# EAGLE design board (EAGLE 6.3)
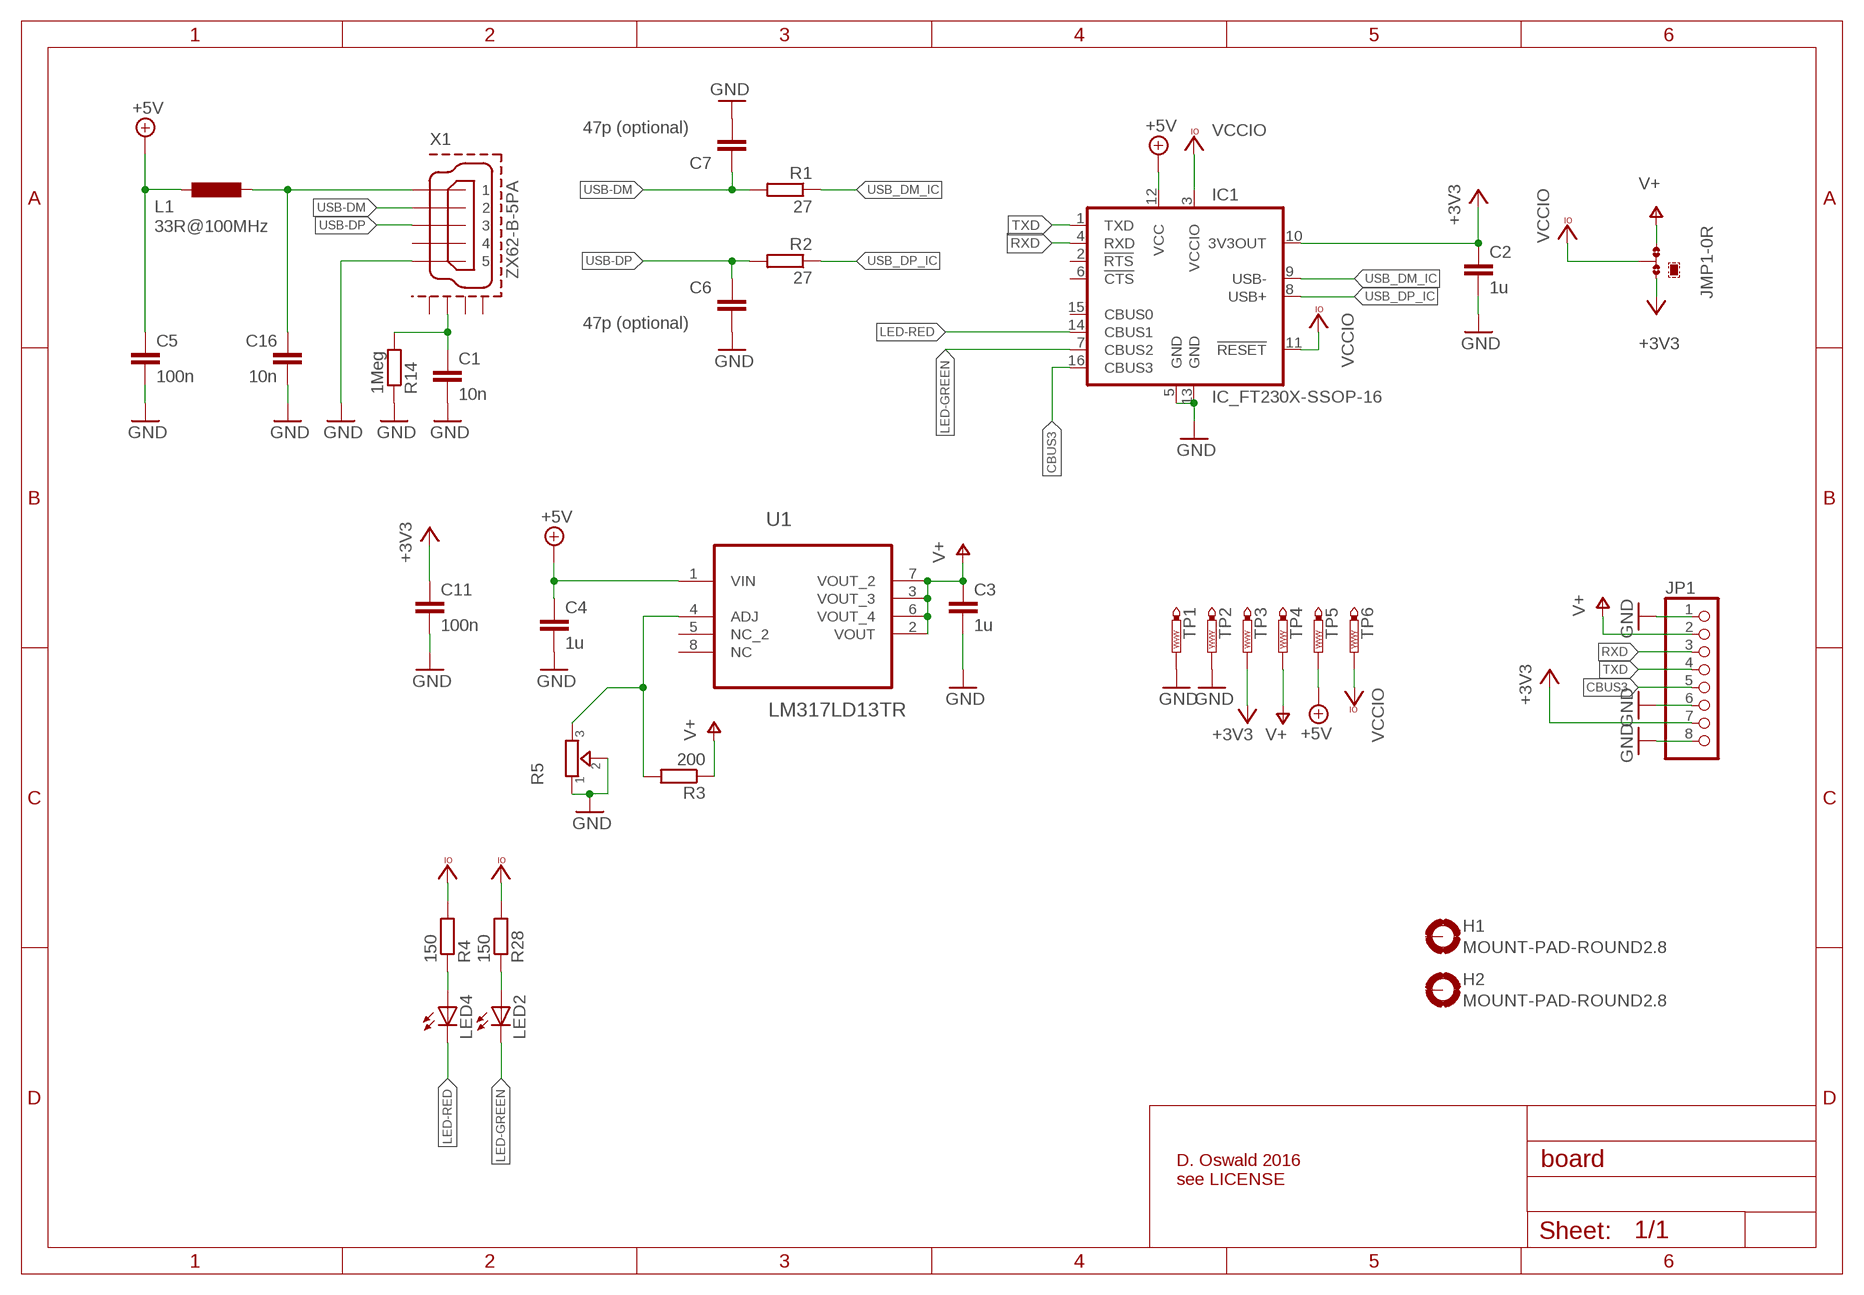
[diagram p0: schematic, sheet 1]

## Parts
C1  10n  C-EUC0603K  [C0603K]
C2  1u  C-EUC0805K  [C0805K]
C3  1u  C-EUC0805K  [C0805K]
C4  1u  C-EUC0805K  [C0805K]
C5  100n  C-EUC0603K  [C0603K]
C6  47p (optional)  C-EUC0603K  [C0603K]
C7  47p (optional)  C-EUC0603K  [C0603K]
C11  100n  C-EUC0603K  [C0603K]
C16  10n  C-EUC0603K  [C0603K]
H1  MOUNT-PAD-ROUND2.8  [2,8-PAD]
H2  MOUNT-PAD-ROUND2.8  [2,8-PAD]
IC1  IC_FT230X-SSOP-16  [SSOP-16-FTDI]
JMP1  0R-JUMPA  [A0R-JMP]
JP1  PINHD-1X8/90  [1X08/90]
L1  33R@100MHz  L-EUL2012C  [L2012C]
LED2  LEDCHIPLED_0805  [CHIPLED_0805]
LED4  LEDCHIPLED_0805  [CHIPLED_0805]
R1  27  R-EU_R0603  [R0603]
R2  27  R-EU_R0603  [R0603]
R3  200  R-EU_R0805  [R0805]
R4  150  R-EU_R0603  [R0603]
R5  TRIMMER-3314G  [TRIMMER_3314G]
R14  1Meg  R-EU_R0603  [R0603]
R28  150  R-EU_R0603  [R0603]
TP1  PTR1B1,27  [B1,27]
TP2  PTR1B1,27  [B1,27]
TP3  PTR1B1,27  [B1,27]
TP4  PTR1B1,27  [B1,27]
TP5  PTR1B1,27  [B1,27]
TP6  PTR1B1,27  [B1,27]
U1  LM317LD13TR  [SOIC127P600X175-8N]
X1  ZX62-B-5PA  ZX62-B-5PA-LONG  [ZX62-B-5PA-LONG]

## Nets
+3V3: C2.1 C11.1 IC1.10(3V3OUT) JMP1.1 JP1.7 TP3.TP
+5V: C4.1 C5.1 IC1.12(VCC) L1.2 TP5.TP U1.1(VIN)
CBUS3: IC1.16(CBUS3) JP1.5
GND: C1.2 C2.2 C3.2 C4.2 C5.2 C6.2 C7.1 C11.2 C16.2 IC1.5(GND) IC1.13(GND) JP1.1 JP1.6 JP1.8 R5.1 R5.2 R14.1 TP1.TP TP2.TP X1.5
LED-GREEN: IC1.7(CBUS2) LED2.C
LED-RED: IC1.14(CBUS1) LED4.C
N$1: R3.2 R5.3 U1.4(ADJ)
N$2: LED2.A R28.1
N$3: LED4.A R4.1
N$7: C16.1 L1.1 X1.1
N$59: C1.1 R14.2 X1.P$2(GND2)
RXD: IC1.4(RXD) JP1.3
TXD: IC1.1(TXD) JP1.4
USB-DM: C7.2 R1.2 X1.2
USB-DP: C6.1 R2.2 X1.3
USB_DM_IC: IC1.9(USB-) R1.1
USB_DP_IC: IC1.8(USB+) R2.1
V+: C3.1 JMP1.3 JP1.2 R3.1 TP4.TP U1.2(VOUT) U1.3(VOUT_3) U1.6(VOUT_4) U1.7(VOUT_2)
VCCIO: IC1.3(VCCIO) IC1.11(!RESET) JMP1.2 R4.2 R28.2 TP6.TP
Unconnected: H1.B2,8(MOUNT) H2.B2,8(MOUNT) IC1.2(!RTS) IC1.6(!CTS) IC1.15(CBUS0) U1.5(NC_2) U1.8(NC) X1.4 X1.P$1(GND1) X1.P$5(GND4) X1.P$6(GND3)

## Notes on the sheet
- D. Oswald 2016
  see LICENSE

## Library data of the parts
C1-C7 C11 C16 = rcl:C-EU: CAPACITOR, European symbol
H1 H2 = holes:MOUNT-PAD-ROUND: MOUNTING PAD, round
IC1 = dp_devices:IC_FT230X: BASIC USB to UART IC
JMP1 = jump-0r-smd:0R-JUMP: SMD 0R 0805 Jumper
JP1 = pinhead:PINHD-1X8: PIN HEADER
L1 = rcl:L-EU: INDUCTOR, European symbol
LED2 LED4 = adafruit:LED: LED OSRAM: - CHIPLED LG R971, LG N971, LY N971, LG Q971, LY Q971, LO R971, LY R971 LH N974, LH R974 LS Q976, LO Q976, LY Q976 LO Q996 - Hyper CHIPLED LW Q18S LB Q993, LB Q99A, LB R99A - SideLED LS A670, LO A670, LY A670, LG A670, LP A670 LB A673, LV A673, LT A673, LW A673 LH A674 LY A675 LS A676, LA A676, LO A676, LY A676, LW A676 LS A679, LY A679, LG A679 - Hyper Micro SIDELED® LS Y876, LA Y876, LO Y876, LY Y876 LT Y87S - SmartLED LW L88C, LW L88S LB L89C, LB L89S, LG L890 LS L89K, LO L89K, LY L89K LS L896, LA L896, LO L896, LY L896 - TOPLED LS T670, LO T670, LY T670, LG T670, LP T670 LSG T670, LSP T670, LSY T670, LOP T670, LYG T670 LG T671, LOG T671, LSG T671 LB T673, LV T673, LT T673, LW T673 LH T674 LS T676, LA T676, LO T676, LY T676, LB T676, LH T676, LSB T676, LW T676 LB T67C, LV T67C, LT T67C, LS T67K, LO T67K, LY T67K, LW E67C LS E67B, LA E67B, LO E67B, LY E67B, LB E67C, LV E67C, LT E67C LW T67C LS T679, LY T679, LG T679 LS T770, LO T770, LY T770, LG T770, LP T770 LB T773, LV T773, LT T773, LW T773 LH T774 LS E675, LA E675, LY E675, LS T675 LS T776, LA T776, LO T776, LY T776, LB T776 LHGB T686 LT T68C, LB T68C - Hyper Mini TOPLED® LB M676 - Mini TOPLED Santana® LG M470 LS M47K, LO M47K, LY M47K Source: http://www.osram.convergy.de/
R1-R4 R14 R28 = rcl:R-EU_: RESISTOR, European symbol
R5 = dp_devices:TRIMMER: Trimmer resistor
TP1-TP6 = testpad:PTR1: TEST PIN
U1 = lm317ld:LM317LD13TR: Micropower 200 mA Low Dropout Tracking Regulator/Line Driver; MPN: LM317LD13TR; OC_FARNELL: 2253488; OC_NEWARK: 89K0679; PACKAGE: SOIC-8; SUPPLIER: STMICROELECTRONICS
X1 = Hirose-USB:ZX62-B-5PA

## Board
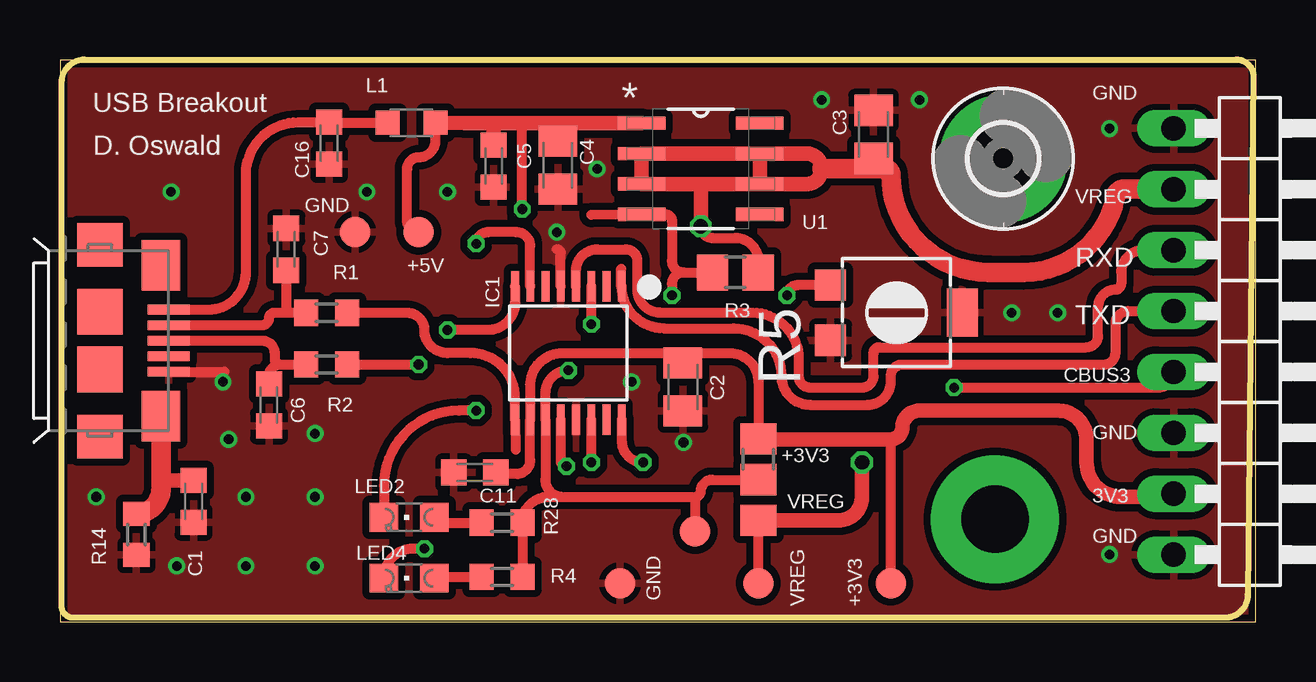
[diagram p1: board, top side]
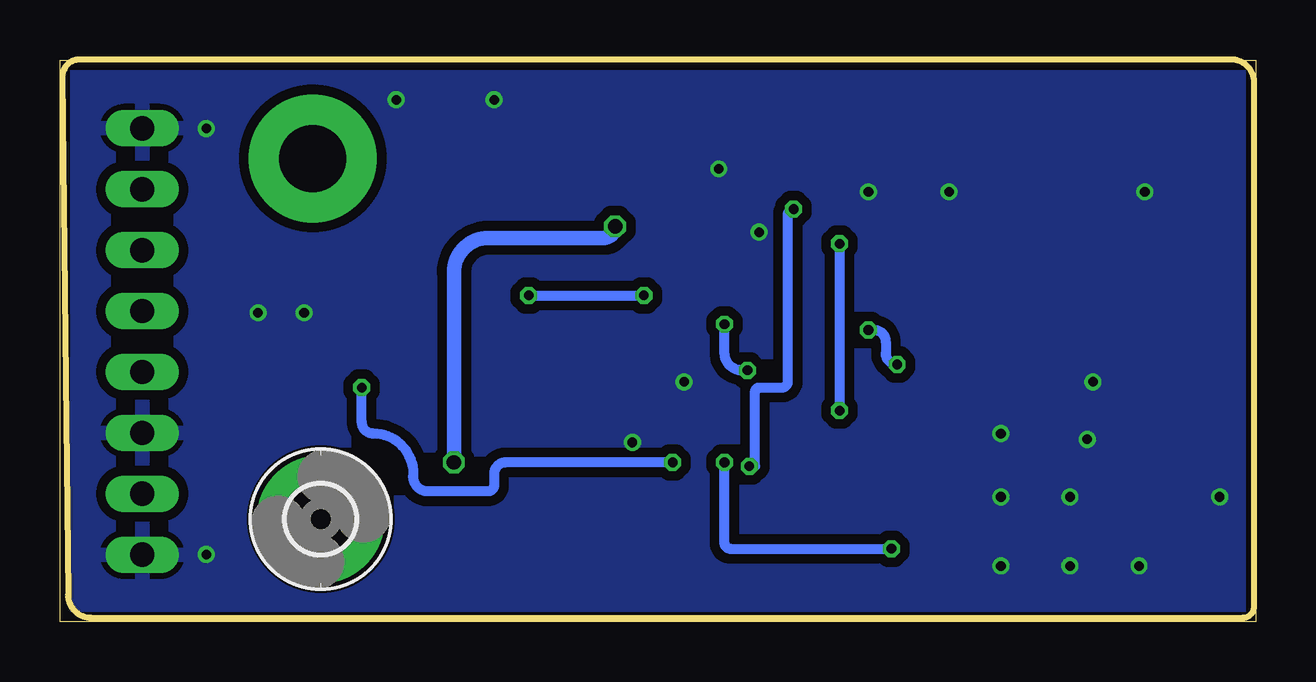
[diagram p2: board, bottom side, seen from below]

Size 49.85 x 23.43 mm. Coordinates in mm from the lower left corner, seen from the top.
Outline: 0,23.43 0,0 49.85,0 49.85,23.43 0,23.43
Copper layers (1*16): Top 0.035mm / dielectric 1.5mm / Bottom 0.035mm
Design rules "dirt_cheap_dirty_boards.v1": minimum track width 5mil, minimum drill 12mil, track to track 5mil, track to pad 5mil, pad to pad 5mil, via to via 5mil, smd to smd 0mil, copper to edge 10mil, drill to drill 10mil, minimum pad ring 10mil, minimum via ring 6mil, stop-mask expansion 2mil, vias tented up to drill 25mil, thermal gap 10mil
Milling: 8 lines

### Footprints (pad centres in the part's own frame; a part is rotated, then mirrored left to right if it is on the bottom)
C0603K = smd 1.05 x 1.08: 1 -0.875,0; 2 0.875,0
C0805K = smd 1.3 x 1.6: 1 -1,0; 2 1,0
2,8-PAD = drill 2.8 pad 5.334: B2,8 0,0
SSOP-16-FTDI = smd 0.32 x 1.26: 1 -2.223,-2.779; 2 -1.588,-2.779; 3 -0.953,-2.779; 4 -0.318,-2.779; 5 0.317,-2.779; 6 0.952,-2.779; 7 1.587,-2.779; 8 2.222,-2.779; 9 2.222,2.779; 10 1.587,2.779; 11 0.952,2.779; 12 0.317,2.779; 13 -0.318,2.779; 14 -0.953,2.779; 15 -1.588,2.779; 16 -2.223,2.779
A0R-JMP = smd 1.5 x 1.3: 1 0,1.7; 2 0,0; 3 0,-1.7
1X08/90 = drill 1.016 long: 1 -8.89,-3.81; 2 -6.35,-3.81; 3 -3.81,-3.81; 4 -1.27,-3.81; 5 1.27,-3.81; 6 3.81,-3.81; 7 6.35,-3.81; 8 8.89,-3.81
L2012C = smd 1 x 1: 1 -1,0; 2 1,0
CHIPLED_0805 = smd 1.2 x 1.2: A 0,-1.05; C 0,1.05
R0603 = smd 1 x 1.1: 1 -0.85,0; 2 0.85,0
R0805 = smd 1.3 x 1.5: 1 -0.95,0; 2 0.95,0
TRIMMER_3314G = smd 1.3 x 1.3: 1 -1.15,2.75; 3 1.15,2.75 | smd 2 x 1.3: 2 0,-2.75
B1,27 = smd 1.27 x 1.27: TP 0,0
SOIC127P600X175-8N = smd 1.981 x 0.559: 1 -2.464,1.905; 2 -2.464,0.635; 3 -2.464,-0.635; 4 -2.464,-1.905; 5 2.464,-1.905; 6 2.464,-0.635; 7 2.464,0.635; 8 2.464,1.905
ZX62-B-5PA-LONG = smd 0.4 x 1.75: 1 -1.3,2.875; 2 -0.65,2.875; 3 0,2.875; 4 0.65,2.875; 5 1.3,2.875 | smd 2.1 x 1.6: P$1 -3.15,2.55; P$2 3.15,2.55 | smd 1.8 x 1.9: P$3 -4,0; P$4 4,0 | smd 1.9 x 1.9: P$5 -1.2,0; P$6 1.2,0

### Placement (x,y rotation side)
C1  5.57,5.03 270 top
C2  25.96,9.8 270 top
C3  33.91,20.33 90 top
C4  20.75,19.04 270 top
C5  18.08,19 270 top
C6  8.71,9.05 270 top
C7  9.43,15.53 270 top
C11  17.29,6.23 180 top
C16  11.22,19.96 270 top
H1  39.32,19.32 0 top
H2  38.98,4.28 0 bottom
IC1  21.19,11.21 180 top
JMP1  29.11,5.93 0 top
JP1  50.23,11.69 270 top
L1  14.65,20.81 0 top
LED2  14.55,4.36 90 top
LED4  14.55,1.82 90 top
R1  11.11,12.89 180 top
R2  11.11,10.73 180 top
R3  28.15,14.57 180 top
R4  18.43,1.88 0 top
R5  34.87,12.89 90 top
R14  3.19,3.64 90 top
R28  18.43,4.14 0 top
TP1  23.35,1.61 0 top
TP2  12.31,16.25 0 top
TP3  34.63,1.61 0 top
TP4  29.11,1.61 0 top
TP5  14.95,16.25 0 top
TP6  26.47,3.77 0 top
U1  26.71,18.89 0 top
X1  1.66,11.72 270 top

### Tracks (layer width: path | path; a pad name or v marks a point on that pad's centre or on a via)
+3V3
  Top 0.406: 26.23,11.21 20.95,11.21 arc90 19.6,9.86 IC1.10 19.6,6.74 arc-90 19.03,6.17 18.16,6.17 C11.1 | 26.23,11.21 27.91,11.21 arc-90 29.11,10.01 JMP1.1 | C2.1 25.96,10.95 arc-90 26.23,11.21 | TP3.TP 34.63,7.61
  Top 0.61: JMP1.1 29.13,7.61 34.63,7.61 arc90 35.11,8.09 arc-90 35.83,8.81 41.59,8.81 arc-90 42.79,7.61 42.79,6.65 arc90 44.23,5.21 46.29,5.21 arc90 JP1.7
+5V  (via drill 0.4)
  Top 0.406: v19.27,17.21 19.27,20.55 arc90 19.03,20.8 | IC1.12 20.87,6.73 arc90 v21.11,6.49 | TP5.TP arc-90 14.47,16.73 14.47,18.89 arc-90 14.95,19.37 arc90 15.65,20.07 L1.2
  Top 0.61: U1.1 20.71,20.8 | 20.71,20.8 19.03,20.8 18.07,20.8 | 18.07,20.8 16.87,20.8 L1.2 | 20.71,20.8 20.75,20.75 C4.1 | 18.07,20.8 18.08,20.79 C5.1
  Bottom 0.406: v19.27,17.21 arc-90 19.51,16.97 19.51,10.01 arc90 19.75,9.77 20.71,9.77 arc-90 20.87,9.61 20.87,6.49 v21.11,6.49
CBUS3  (via drill 0.4)
  Top 0.406: IC1.16 23.41,7.55 arc90 v24.31,6.65 | v37.27,9.77 45.77,9.77 arc90 JP1.5
  Bottom 0.406: v24.31,6.65 31.27,6.65 arc-90 31.75,6.17 31.75,5.69 arc90 31.99,5.45 34.63,5.45 arc90 35.11,6.17 arc-90 36.79,7.85 arc90 37.27,8.33 v37.27,9.77
GND  (via drill 0.4)
  Top 0.406: X1.5 6.86,10.42 | IC1.5 20.87,15.37 arc90 20.71,15.53
  other vias: 25.99,7.48 12.79,17.93 16.15,17.93 7.75,5.21 43.75,2.81 23.83,10.01 7.75,2.33 4.87,2.33 1.51,5.21 6.79,10.01 10.63,5.21 31.75,21.77 35.83,21.77 43.75,20.57 20.71,16.25 22.39,18.89 39.67,12.89 10.63,2.33 10.63,7.85 4.63,17.93 41.59,12.89 7.03,7.61
  pour Top (isolate 0.305, rank 3): 0,23.43 49.85,23.43 49.85,0.24 0,0.24
  pour Bottom (isolate 0.406, rank 6): 0.07,23.21 49.75,23.21 49.75,0.17 0.07,0.17
LED-GREEN  (via drill 0.4)
  Top 0.406: IC1.7 19.6,15.68 arc90 19.03,16.25 17.83,16.25 arc90 v17.35,15.77 | v17.35,8.81 16.63,8.81 arc90 13.5,5.68 LED2.C
  Bottom 0.406: v17.35,15.77 v17.35,8.81
LED-RED  (via drill 0.4)
  Top 0.406: v22.15,6.65 IC1.14 arc90 IC1.14 | v15.19,3.05 14.73,3.05 arc90 LED4.C
  Bottom 0.406: v22.15,6.65 22.15,3.29 arc-90 21.91,3.05 v15.19,3.05
N$1  (via drill 0.4)
  Top 0.406: 25.99,14.57 arc-90 25.51,15.05 25.51,16.73 arc90 25.26,16.99 U1.4 22.15,16.97 | 25.99,14.57 R3.2 | R5.3 30.74,14.04 arc90 v30.31,13.61 | 25.99,14.57 arc90 25.51,14.09 v25.51,13.61
  Bottom 0.406: v30.31,13.61 v25.51,13.61
N$2
  Top 0.406: LED2.A arc90 15.82,4.14 R28.1
N$3
  Top 0.406: LED4.A arc-90 15.66,1.88 R4.1
N$7
  Top 0.406: 11.07,20.57 C16.1 | X1.1 6.2,13.02 arc90 7.75,14.57 7.75,18.65 arc-90 9.94,20.84 C16.1 | C16.1 arc90 11.24,20.81 L1.1
  Top 0.61: 13.56,20.72 L1.1
N$59
  Top 0.61: C1.1 4.21,5.91 4.21,6.17
  Top 0.813: X1.P$2 4.21,6.17 4.21,5.62 arc-90 R14.2
RXD
  Top 0.406: JP1.3 45.16,15.5 arc90 44.23,14.57 44.23,14.09 arc-90 43.99,13.85 arc90 43.27,13.13 43.27,11.93 arc-90 42.79,11.45 34.15,11.45 arc90 33.91,11.21 33.91,10.25 arc-90 33.43,9.77 31.27,9.77 arc-90 30.79,10.25 30.79,10.97 arc90 28.87,12.89 25.03,12.89 arc-90 24.07,13.85 24.07,15.05 arc90 23.59,15.53 22.39,15.53 arc90 21.51,14.65 IC1.4
TXD
  Top 0.406: JP1.4 44.54,12.96 arc90 43.99,12.41 43.99,11.21 arc-90 43.51,10.73 35.11,10.73 arc90 34.63,10.25 34.63,10.01 arc-90 33.67,9.05 31.27,9.05 arc-90 30.07,10.25 arc90 28.08,12.24 25.16,12.24 arc-90 IC1.1 23.39,13.99 23.39,14.73
USB-DM
  Top 0.406: X1.2 8.43,12.37 arc90 8.71,12.65 arc-90 8.95,12.89 9.67,12.89 | 9.67,12.89 R1.2 | C7.2 9.43,13.13 arc90 9.67,12.89
USB-DP
  Top 0.406: X1.3 8.44,11.72 arc-90 8.95,11.21 8.95,10.97 arc90 9.19,10.73 | 9.19,10.73 R2.2 | C6.1 8.71,10.25 arc-90 9.19,10.73
USB_DM_IC
  Top 0.406: R1.1 14.47,12.89 arc-90 15.19,12.17 arc90 16.15,11.21 17.11,11.21 arc-90 18.97,9.35 IC1.9 18.99,7.17
USB_DP_IC  (via drill 0.4)
  Top 0.406: IC1.8 18.97,13.31 arc-90 17.83,12.17 v16.15,12.17 | R2.1 v14.95,10.73
  Bottom 0.406: v16.15,12.17 15.91,12.17 arc90 15.43,11.69 15.43,11.21 arc-90 v14.95,10.73
V+  (via drill 0.6)
  Top 0.406: v26.71,16.49 arc90 27.19,16.01 28.15,16.01 arc-90 29.1,15.06 R3.1 | TP4.TP JMP1.3
  Top 0.61: 26.71,18.26 U1.3 U1.2 U1.7 31.12,19.52 arc-90 31.75,18.89 arc-90 31.12,18.26 U1.6 | 26.71,18.26 U1.6 | U1.6 29.17,19.31 29.11,19.37 | 26.71,18.26 v26.71,16.49 | JMP1.3 32.45,4.23 arc90 33.43,5.21 v33.43,6.65
  Top 0.813: JP1.2 44.34,18.04 arc90 43.99,17.69 arc-78 40.15,14.57 38.71,14.57 arc-90 34.63,18.65 arc90 34.39,18.89 34.15,18.89 | 34.15,18.89 31.75,18.89 | C3.1 34.15,19.33 34.15,18.89
  Bottom 0.61: v33.43,6.65 33.43,14.57 arc90 31.99,16.01 27.19,16.01 arc-90 v26.71,16.49
VCCIO  (via drill 0.4)
  Top 0.406: 20.95,5.21 arc-90 20.23,5.93 IC1.11 20.24,9.54 arc-90 v21.19,10.49 | 20.95,5.21 26.47,5.21 | 26.47,5.21 arc90 26.71,5.45 arc-90 27.19,5.93 JMP1.2 | IC1.3 v22.14,12.42 arc90 v22.15,12.41 | 26.47,5.21 TP6.TP | 20.95,5.21 20.35,5.21 arc90 R28.2 R4.2
  Bottom 0.406: v22.15,12.41 22.15,11.21 arc-90 21.43,10.49 v21.19,10.49

### Text on the board
tNames: GND | USB Breakout | D. Oswald | GND | VREG | +5V | RXD | TXD | CBUS3 | GND | +3V3 | VREG | 3V3 | GND | GND | VREG | +3V3